# Altium schematic sheet conf.SchDoc
size A4
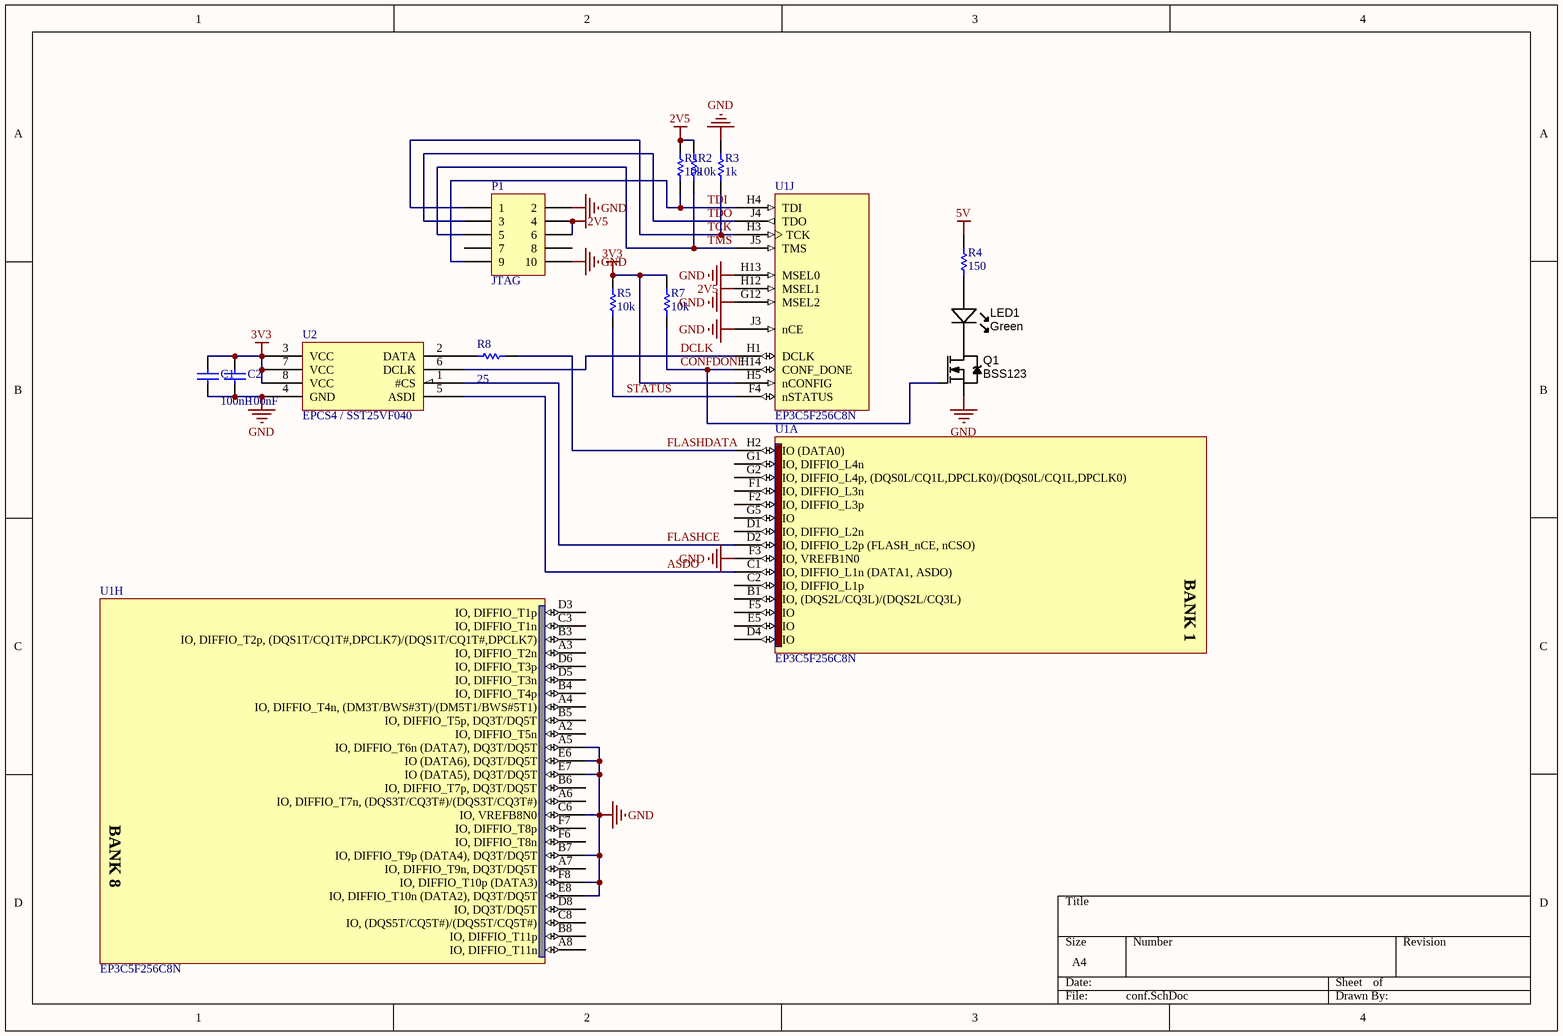
[diagram p0: conf.SchDoc]

## Parts
C1  value 100nF  [CAPC1005X06L]
C2  value 100nF  [CAPC1005X06L]
LED1  Green  [LED-0603-GREEN]
P1  JTAG  [HDR2X5]
Q1  BSS123  [SOT23-3]
R1  value 10k  [RESC2012X70N]  (hidden comment: Res1)
R2  value 10k  [RESC2012X70N]  (hidden comment: Res1)
R3  value 1k  [RESC2012X70N]  (hidden comment: Res1)
R4  value 150  [RESC2012X70N]  (hidden comment: Res1)
R5  value 10k  [RESC2012X70N]  (hidden comment: Res1)
R7  value 10k  [RESC2012X70N]  (hidden comment: Res1)
R8  value 25  [RESC2012X70N]  (hidden comment: Res1)
U1  EP3C5F256C8N  [FBGA256-2]  (parts A,H,J of 13)
U2  EPCS4 / SST25VF040  [SOIC127P600X175-8AN]

## Nets
2V5: P1.4 P1.6 R1.2 R2.2 U1.H12(MSEL1)
3V3: C1.2 C2.2 R5.2 R7.2 U1.H5(nCONFIG) U2.3(VCC) U2.7(VCC) U2.8(VCC)
5V: R4.2
GND: C1.1 C2.1 P1.2 P1.10 Q1.2(S) R3.2 U1.A5(IO,_DIFFIO_T6n_(DATA7),_DQ3T/DQ5T) U1.B7(IO,_DIFFIO_T9p_(DATA4),_DQ3T/DQ5T) U1.C6(IO,_VREFB8N0) U1.E6(IO_(DATA6),_DQ3T/DQ5T) U1.E7(IO_(DATA5),_DQ3T/DQ5T) U1.E8(IO,_DIFFIO_T10n_(DATA2),_DQ3T/DQ5T) U1.F3(IO,_VREFB1N0) U1.F8(IO,_DIFFIO_T10p_(DATA3)) U1.G12(MSEL2) U1.H13(MSEL0) U1.J3(nCE) U2.4(GND)
ASDO: U1.C1(IO,_DIFFIO_L1n_(DATA1,_ASDO)) U2.5(ASDI)
CONFDONE: Q1.1(G) R7.1 U1.H14(CONF_DONE)
DCLK: U1.H1(DCLK) U2.6(DCLK)
FLASHCE: U1.D2(IO,_DIFFIO_L2p_(FLASH_nCE,_nCSO)) U2.1(#CS)
FLASHDATA: R8.2 U1.H2(IO_(DATA0))
STATUS: R5.1 U1.F4(nSTATUS)
TCK: P1.1 R3.1 U1.H3(TCK)
TDI: P1.9 R1.1 U1.H4(TDI)
TDO: P1.3 U1.J4(TDO)
TMS: P1.5 R2.1 U1.J5(TMS)
NetLED1_A: LED1.A R4.1
NetLED1_K: LED1.K Q1.3(D)
NetR8_1: R8.1 U2.2(DATA)

Not connected (* = marked no-connect by the designer): P1 7 8; U1 A2(IO,_DIFFIO_T5n) A3(IO,_DIFFIO_T2n) A4(IO,_DIFFIO_T4n,_(DM3T/BWS#3T)/(DM5T1/BWS#5T1)) A6(IO,_DIFFIO_T7n,_(DQS3T/CQ3T#)/(DQS3T/CQ3T#)) A7(IO,_DIFFIO_T9n,_DQ3T/DQ5T) A8(IO,_DIFFIO_T11n) B1(IO,_(DQS2L/CQ3L)/(DQS2L/CQ3L)) B3(IO,_DIFFIO_T2p,_(DQS1T/CQ1T#,DPCLK7)/(DQS1T/CQ1T#,DPCLK7)) B4(IO,_DIFFIO_T4p) B5(IO,_DIFFIO_T5p,_DQ3T/DQ5T) B6(IO,_DIFFIO_T7p,_DQ3T/DQ5T) B8(IO,_DIFFIO_T11p) C2(IO,_DIFFIO_L1p) C3(IO,_DIFFIO_T1n) C8(IO,_(DQS5T/CQ5T#)/(DQS5T/CQ5T#)) D1(IO,_DIFFIO_L2n) D3(IO,_DIFFIO_T1p) D4(IO) D5(IO,_DIFFIO_T3n) D6(IO,_DIFFIO_T3p) D8(IO,_DQ3T/DQ5T) E5(IO) F1(IO,_DIFFIO_L3n) F2(IO,_DIFFIO_L3p) F5(IO) F6(IO,_DIFFIO_T8n) F7(IO,_DIFFIO_T8p) G1(IO,_DIFFIO_L4n) G2(IO,_DIFFIO_L4p,_(DQS0L/CQ1L,DPCLK0)/(DQS0L/CQ1L,DPCLK0)) G5(IO)

## Notes on the sheet
- (in symbol EP3C5F256C8N, part A) BANK 1
- (in symbol EP3C5F256C8N, part H) BANK 8

## Library data of the parts
C1 C2 = Cap: Capacitor; Published: 8-Jun-2000; LatestRevisionDate: 17-Jul-2002; LatestRevisionNote: Re-released for DXP Platform.; PackageReference: RAD-0.3; Publisher: Altium Limited; PackageDescription: Radial Cap, Thru-Hole; 2 Leads; 0.3 in Pin Spacing
LED1 = LED_SMD_Green_0603_570nm: LED 0603 SMD Green 570nm 50mcd 20mA; Manufacturer 1: Kingbright Company LLC; Manufacturer Part Number 1: APT1608CGCK; Material: AlGaInP; Ratings: 20mcd min; 50 mcd typ; 570 nm; Voltage - Forward (Vf) Typ: 2.1V; Viewing Angle: 120°; Lens Style/Size: Rectangle with Flat Top, 1.1mm x 0.8mm; Voltage - Forward (Vf) @ 10mA: 2.0V; SCDType: source; Wavelength - Peak: 574nm; Lens Type: Clear; Package / Case: 0603 (1608 metric); Color: Green; Current - Test: 20mA; Supplier 1: Digi-Key; Supplier Part Number 1: 754-1116-1-ND; RoHS 1: RoHS Compliant; Wavelength - Dominant: 570nm; ComponentLink1URL: http://www.us.kingbright.com/images/catalog/SPEC/APT1608CGCK.pdf; ComponentLink1Description: http://www.us.kingbright.com/images/catalog/SPEC/APT1608CGCK.pdf
P1 = Header 5X2: Header, 5-Pin, Dual row; LatestRevisionDate: 17-Jul-2002; LatestRevisionNote: Re-released for DXP Platform.; Publisher: Altium Limited
Q1 = MOSFET_BSS123: MOSFET SMD N-CH 100V 170mA SOT23-3; Manufacturer 1: Diodes Inc; Manufacturer Part Number 1: BSS123-7-F; Ratings: 100V; 170mA; Material: Metal Oxide; SCDType: source; Package / Case: SOT23-3; Supplier 1: Digi-Key; Supplier Part Number 1: BSS123-FDICT-ND
R1-R5 R7 R8 = Res1: Resistor; Published: 8-Jun-2000; LatestRevisionDate: 17-Jul-2002; LatestRevisionNote: Re-released for DXP Platform.; PackageReference: AXIAL-0.3; Publisher: Altium Limited; PackageDescription: Axial Device, Thru-Hole; 2 Leads; 0.3 in Pin Spacing
U1 = EP3C5F256C8N: Cyclone III Family FPGA, 182 I/O Pins, 4 PLLs, 256-Pin FBGA, Speed Grade 8, Commercial Grade, Pb-Free; Published: 14-Mar-2008; DatasheetVersion: ver2.0, May-2008; PackageVersion: ver16.0, Dec-2009; PackageReference: FBGA256-2; Publisher: Altium Limited; PackageDescription: 256-Ball FineLine Ball Grid Array (FBGA256) - Option 2 - Wire Bond; Supplier 1: Digi-Key; Supplier Part Number 1: 544-2423-ND; Supplier 2: Farnell; Supplier Part Number 2: 1549367; Supplier 3: Farnell; Supplier Part Number 3: 1662274; Code_JEDEC: MO-192-DAF-1; ComponentLink1Description: Manufacturer Link; ComponentLink1URL: http://www.altera.com/; ComponentLink2Description: Handbook (7.86MB); ComponentLink2URL: http://www.altera.com/literature/hb/cyc3/cyclone3_handbook.pdf; ComponentLink3Description: Packaging Specification; ComponentLink3URL: http://www.altera.com/literature/ds/dspkg.pdf
U2 = EPCS4